# EAGLE design pfetreg (EAGLE 7.3.0)
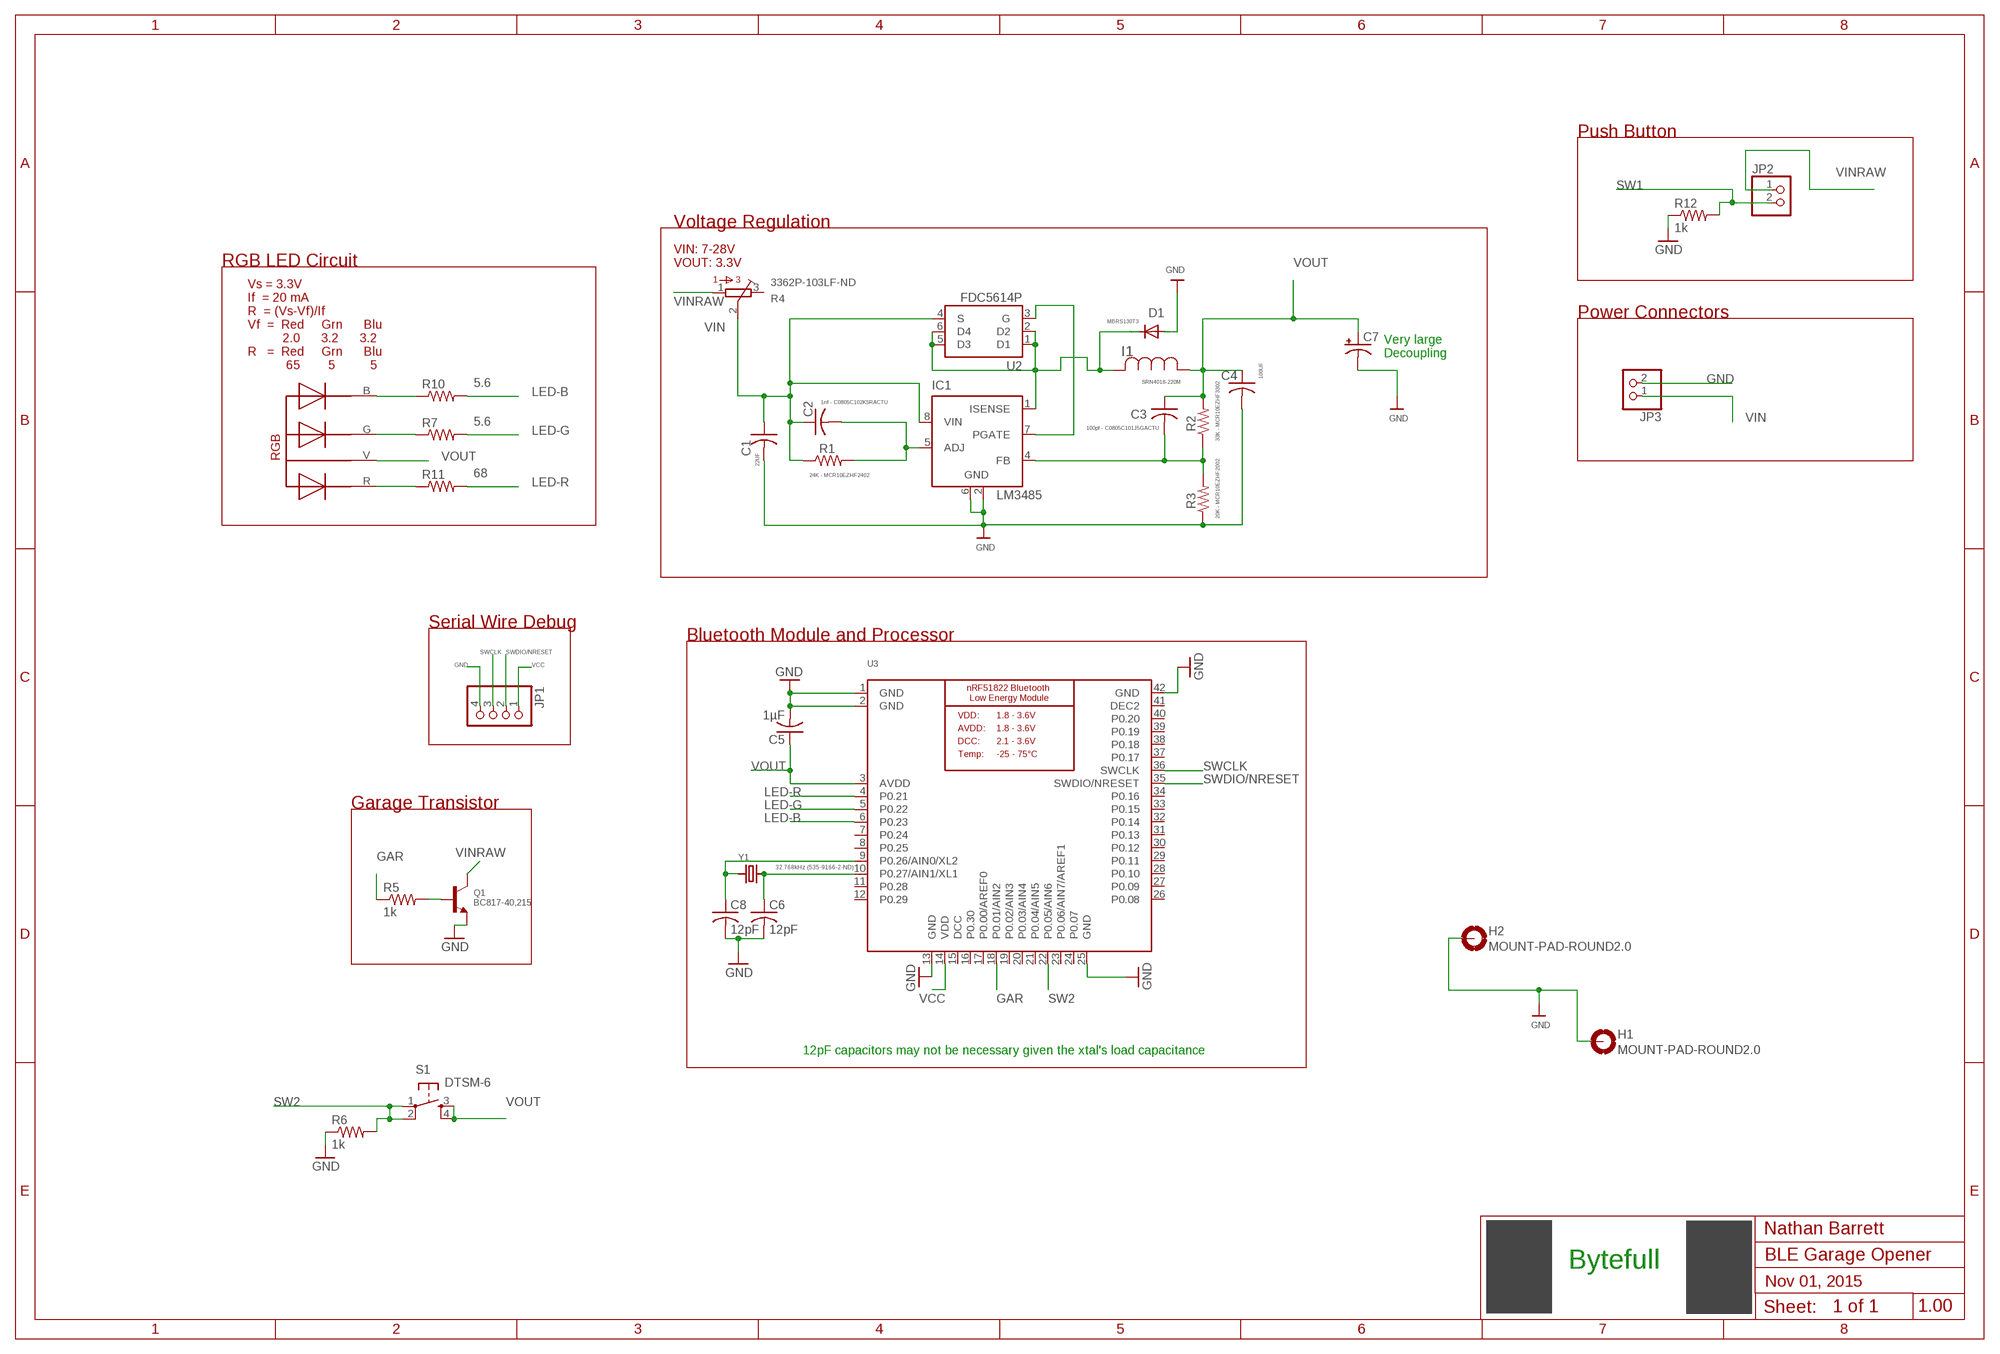
[diagram p0: schematic, sheet 1]

## Parts
C1  22UF  F931V226MNC  [CAPCP7343X430N]
C2  1nf - C0805C102K5RACTU  C-USC0805K  [C0805K]
C3  100pf - C0805C101J5GACTU  C-USC0805K  [C0805K]
C4  100UF  6TPC100M  [CAPCP7343X430N]
C5  1µF  C-USC0805K  [C0805K]
C6  12pF  C-USC0805  [C0805]
C7  CPOL-USE5-10.5  [E5-10,5]
C8  12pF  C-USC0805  [C0805]
D1  MBRS130T3  DIODE-DO214AA  [DO214AA]
H1  MOUNT-PAD-ROUND2.0  [2,0-PAD]
H2  MOUNT-PAD-ROUND2.0  [2,0-PAD]
I1  SRN4018-220M  [SRN4018-220M]
IC1  LM3485  [MSOP08]
JP1  PINHD-1X4  [1X04]
JP2  PINHD-1X2  [1X02]
JP3  PINHD-1X2  [1X02]
Q1  BC817-40,215  TRANSISTOR_NPN  [SOT23-R]
R1  24K - MCR10EZHF2402  R-US_R0805W  [R0805W]
R2  33K - MCR10EZHF3302  R-US_R0805W  [R0805W]
R3  20K - MCR10EZHF2002  R-US_R0805W  [R0805W]
R4  3362P-103LF-ND  3362P  [3362P]
R5  1k  R-US_R0805  [R0805]
R6  1k  R-US_R0805  [R0805]
R7  5.6  R-US_R0805  [R0805]
R10  5.6  R-US_R0805  [R0805]
R11  68  R-US_R0805  [R0805]
R12  1k  R-US_R0805  [R0805]
RGB  5MMRGBLED  [LED5MMRGB]
S1  DTSM-6  [DTSM-6]
U2  FDC5614PSOT-23  [SOT23-6]
U3  NRF51822_MODULE_MDBT40  [BLE_MODULE_RAYTAC_MDBT40]
Y1  CRYSTAL8X3.8SMT  [CRYSTAL_8X3.8]

## Nets
GAR: R5.1 U3.18(P0.01/AIN2)
GND: C1.2(I2) C4.2(I2) C5.2 C6.2 C7.- C8.2 D1.A H1.B2,8(MOUNT) H2.B2,8(MOUNT) IC1.2(GND) IC1.6(GND) JP1.4 JP3.2 Q1.2(E) R3.1 R6.1 R12.1 U3.1(GND) U3.2(GND) U3.13(GND) U3.25(GND) U3.42(GND)
LED-B: R10.2 U3.6(P0.23)
LED-G: R7.2 U3.5(P0.22)
LED-R: R11.2 U3.4(P0.21)
N$1: D1.C I1.1(I1) IC1.1(ISENSE) U2.1(D1) U2.2(D2) U2.5(D3) U2.6(D4)
N$2: C3.2 IC1.4(FB) R2.1 R3.2
N$3: IC1.7(PGATE) U2.3(G)
N$4: C2.2 IC1.5(ADJ) R1.2
N$5: Q1.1(B) R5.2
N$6: R7.1 RGB.G
N$7: R10.1 RGB.B
N$8: R11.1 RGB.R
N$11: C8.1 U3.9(P0.26/AIN0/XL2) Y1.P$1
N$16: C6.1 U3.10(P0.27/AIN1/XL1) Y1.P$4
SW1: JP2.2 R12.2
SW2: R6.2 S1.1 S1.2 U3.22(P0.05/AIN6)
SWCLK: JP1.3 U3.36(SWCLK)
SWDIO/NRESET: JP1.2 U3.35(SWDIO/NRESET)
VCC: JP1.1 U3.14(VDD)
VIN: C1.1(I1) C2.1 IC1.8(VIN) JP3.1 R1.1 R4.2 U2.4(S)
VINRAW: JP2.1 Q1.3(C) R4.1
VOUT: C3.1 C4.1(I1) C5.1 C7.+ I1.2(I2) R2.2 RGB.V S1.3 S1.4 U3.3(AVDD)
Unconnected: R4.3 U3.7(P0.24) U3.8(P0.25) U3.11(P0.28) U3.12(P0.29) U3.16(P0.30) U3.17(P0.00/AREF0) U3.19(P0.02/AIN3) U3.20(P0.03/AIN4) U3.21(P0.04/AIN5) U3.23(P0.06/AIN7/AREF1) U3.24(P0.07) U3.26(P0.08) U3.27(P0.09) U3.28(P0.10) U3.29(P0.11) U3.30(P0.12) U3.31(P0.13) U3.32(P0.14) U3.33(P0.15) U3.34(P0.16) U3.37(P0.17) U3.38(P0.18) U3.39(P0.19) U3.40(P0.20)

## Notes on the sheet
- Push Button
- Voltage Regulation
- RGB LED Circuit
- VIN: 7-28V
  VOUT: 3.3V
- Power Connectors
- Very large
  Decoupling
- Vs = 3.3V
  If  = 20 mA
  R  = (Vs-Vf)/If
  Vf  =  Red     Grn      Blu
            2.0      3.2      3.2
  R   =  Red     Grn      Blu
             65        5          5
- Serial Wire Debug
- Bluetooth Module and Processor
- Garage Transistor
- 32.768kHz (535-9166-2-ND)
- 12pF capacitors may not be necessary given the xtal's load capacitance

## Power pins joined to a net without a drawn wire
DCC: U3.15(DCC)
DEC2: U3.41(DEC2)

## Library data of the parts
C1 = pfetreg:F931V226MNC: Tantalum Capacitor , 2917; CAPACITANCETOLERANCE: ±20%; MPN: F931V226MNC; SUPPLIER: AVX; VOLTAGERATING: 35V
C2 C3 = Bluetooth-Garage:C-US: CAPACITOR, American symbol
C4 = pfetreg:6TPC100M: Poly Capacitor , 2917; CAPACITANCETOLERANCE: ±20%; MPN: 6TPC100M; SUPPLIER: PANASONIC; VOLTAGERATING: 6.3V
C5 C6 C8 = HelloWorld:C-US: CAPACITOR, American symbol
C7 = rcl:CPOL-US: POLARIZED CAPACITOR, American symbol
D1 = diode:DIODE-: DIODE
H1 H2 = holes:MOUNT-PAD-ROUND: MOUNTING PAD, round
I1 = pfetreg:SRN4018-220M: FIXED IND 22UH 900MA 348 MOHM SRN4018-220M
IC1 = linear:LM3485: Hysteretic PFET Buck Controller Source: http://cache.national.com/ds/LM/LM3485.pdf
JP1 = HelloWorld:PINHD-1X4: PIN HEADER
JP2 JP3 = pinhead:PINHD-1X2: PIN HEADER
Q1 = HelloWorld:TRANSISTOR_NPN: NPN Transistor Transistor (NPN) 500mA 45V - BC817 [Digikey: 568-1631-1-ND] Transistor (NPN) 500mA 45V - BC817,215 [Mouser: 771-BC817-T/R] SOT23-R - SOT23 footprint optimised for use with solder paste and reflow ovens. SOT23-W - SOT23 footprint optimised for hand-soldering (larger pads).
R1-R3 = Bluetooth-Garage:R-US_: RESISTOR, American symbol
R4 = Bourns:3362: 3362 Series 1/4" Square Trimmer
R5-R7 R10-R12 = HelloWorld:R-US_: RESISTOR, American symbol
RGB = led_rgb:5MMRGBLED
S1 = HelloWorld:DTSM-6
U2 = pfetreg:FDC5614P: Fairchild P-channel MOSFET -60V FDC5614P , SOT23-6
U3 = HelloWorld:NRF51822_MODULE_MDBT40: nRF51822 Bluetooth Low Energy Module
Y1 = HelloWorld:CRYSTAL: Crystals HC49UP - Surface Mount Crystal 4.0MHz 18pF +/-30ppm Surface Mount Crystal [Digikey: 535-9857-1-ND] 12.0 MHz Surface Mount Crystal [Digikey: 535-9869-6-ND] 25.0 MHz Surface Mount Crystal [Digikey: 535-9078-1-ND] 2.5 x 2.0mm - MEMs SMT Crystal 16.0 MHz 10pF 20ppm 2.5 x 2.0mm Crystal [Digikey -40-85°C: 535-10923-1-ND] 3.2 x 2.5mm - MEMs SMT Crystal 12.0 MHz 8pF 15ppm 3.2 x 2.5mm Crystal [Digikey: -10-70°C: 644-1047-1-ND -40-125°C: 644-1128-1-ND] 16.0 MHz 8pF 15ppm 3.2 x 2.5mm Crystal [Digikey: -10-70°C: 644-1049-1-ND -40-125°C: 644-1129-2-ND] 16.0 MHz 10pF 10ppm 3.2 x 2.5mm Crystal [Digikey: 644-1100-1-ND] 27.12 MHz 18pF 30ppm 3.2 x 2.5mm Crystal [Digikey: 887-1424-1-ND] 27.12MHz 10pF 10ppm 3.2 x 2.5mm Crystal [Digikey: 887-1329-1-ND] 4.9 x 1.8mm - MEMs SMT Crystal 32.768 KHz 12.5pF 20ppm 4.9 x 1.8mm Crystal [Digikey: SE2415CT-ND] 8.0 x 3.8mm - Surface Mount Crystal 32.768kHz 12.5pF 20ppm -40°C-85°C [Digikey: 535-9166-2-ND] Cylinder 32.768KHz Cylinder Crystal (2x6mm body) [Ex. Digikey: 300-8341-2-ND]

## Board
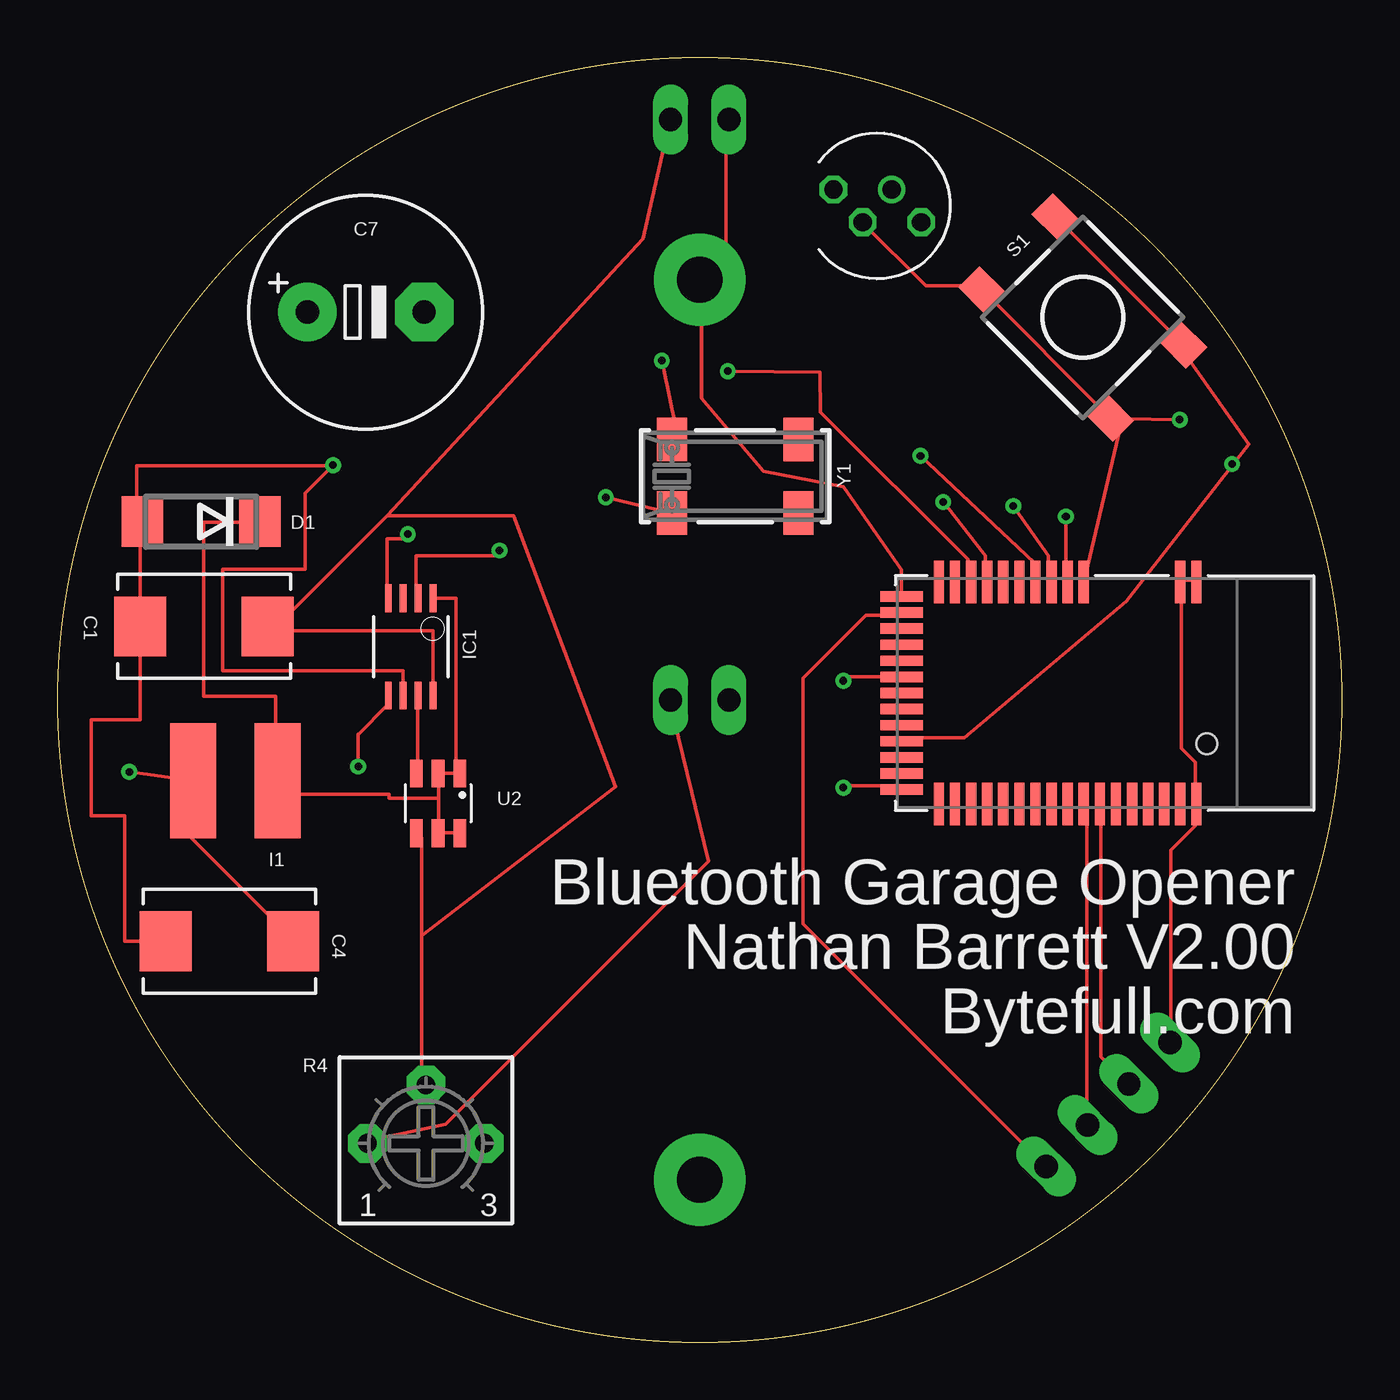
[diagram p1: board, top side]
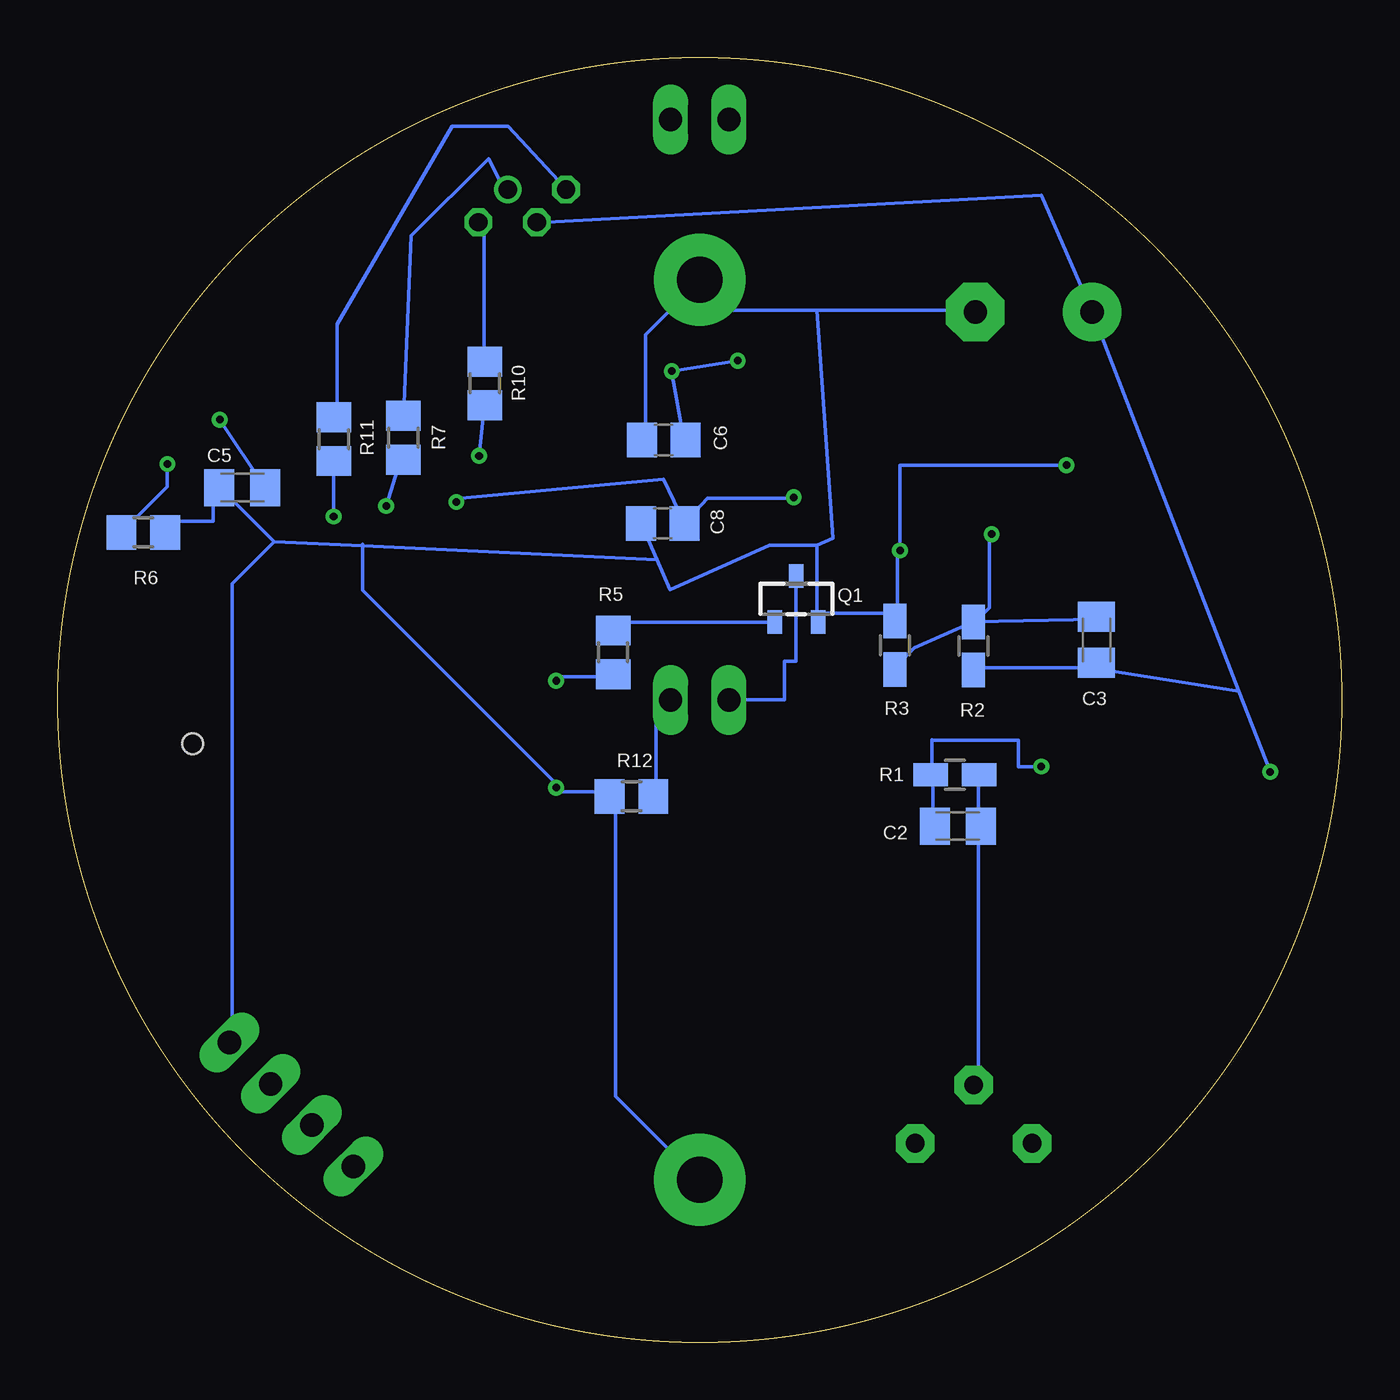
[diagram p2: board, bottom side, seen from below]

Size 55.88 x 55.88 mm. Coordinates in mm from the lower left corner, seen from the top.
Outline: circle at 27.94,27.94 radius 27.94
Copper layers (1*16): Top 0.0356mm / dielectric 1.5011mm / Bottom 0.0356mm
Design rules "oshpark-2layer(2)": minimum track width 6mil, minimum drill 13mil, track to track 6mil, track to pad 6mil, pad to pad 6mil, via to via 6mil, smd to smd 6mil, copper to edge 15mil, drill to drill 6mil, minimum pad ring 7mil, minimum via ring 7mil, stop-mask expansion 4mil, vias tented up to drill 0mil, thermal gap 10mil

### Footprints (pad centres in the part's own frame; a part is rotated, then mirrored left to right if it is on the bottom)
CAPCP7343X430N = smd 2.261 x 2.591: 1 -2.769,0; 2 2.769,0
C0805K = smd 1.3 x 1.6: 1 -1,0; 2 1,0
C0805 = smd 1.3 x 1.5: 1 -0.95,0; 2 0.95,0
E5-10,5 = drill 1.016 pad 2.54: + -2.54,0 | drill 1.016 pad 2.54 octagon: - 2.54,0
DO214AA = smd 1.8 x 2.2: A 2.55,0; C -2.55,0
2,0-PAD = drill 2 pad 4: B2,8 0,0
SRN4018-220M = smd 1.999 x 5: 1 4.37,0; 2 0.69,0
MSOP08 = smd 0.3 x 1.2: 1 -0.976,-2.113; 2 -0.326,-2.113; 3 0.324,-2.113; 4 0.974,-2.113; 5 0.974,2.112; 6 0.324,2.112; 7 -0.326,2.112; 8 -0.976,2.112
1X04 = drill 1.016 long: 1 -3.81,0; 2 -1.27,0; 3 1.27,0; 4 3.81,0
1X02 = drill 1.016 long: 1 -1.27,0; 2 1.27,0
SOT23-R = smd 0.635 x 1.016: 1 -0.95,-1; 2 0.95,-1; 3 0,1
R0805W = smd 1.5 x 1: 1 -1.052,0; 2 1.052,0
3362P = drill 0.813 pad 1.676 octagon: 1 -2.54,0; 2 0,2.54; 3 2.54,0
R0805 = smd 1.3 x 1.5: 1 -0.95,0; 2 0.95,0
LED5MMRGB = drill 0.8 pad 0.813 octagon: B 1.905,-0.714; R -1.905,0.714; V -0.635,-0.714 | drill 0.8 pad 0.813: G 0.635,0.714
DTSM-6 = smd 1.55 x 1.3: 1 -3.975,2.25; 2 3.975,2.25; 3 -3.975,-2.25; 4 3.975,-2.25
SOT23-6 = smd 0.55 x 1.2: 1 0.95,1.3; 2 0,1.3; 3 -0.95,1.3; 4 -0.95,-1.3; 5 0,-1.3; 6 0.95,-1.3
BLE_MODULE_RAYTAC_MDBT40 = smd 1.85 x 0.45: 1 -4.825,4; 2 -4.825,3.3; 3 -4.825,-0.9; 4 -4.825,-1.6; 5 -4.825,-2.3; 6 -4.825,-3; 7 -4.825,-3.7; 8 -4.825,-4.4; 9 -4.825,-5.1; 10 -4.825,-5.8; 11 -4.825,-6.5; 12 -4.825,-7.2; 26 4.825,-7.2; 27 4.825,-6.5; 28 4.825,-5.8; 29 4.825,-5.1; 30 4.825,-4.4; 31 4.825,-3.7; 32 4.825,-3; 33 4.825,-2.3; 34 4.825,-1.6; 35 4.825,-0.9; 36 4.825,-0.2; 37 4.825,0.5; 38 4.825,1.2; 39 4.825,1.9; 40 4.825,2.6; 41 4.825,3.3; 42 4.825,4 | smd 0.45 x 1.85: 13 -4.2,-8.825; 14 -3.5,-8.825; 15 -2.8,-8.825; 16 -2.1,-8.825; 17 -1.4,-8.825; 18 -0.7,-8.825; 19 0,-8.825; 20 0.7,-8.825; 21 1.4,-8.825; 22 2.1,-8.825; 23 2.8,-8.825; 24 3.5,-8.825; 25 4.2,-8.825 | hole 0.9: 2.2,4.45
CRYSTAL_8X3.8 = smd 1.3 x 1.9: P$1 -2.75,-1.6; P$2 2.75,-1.6; P$3 2.75,1.6; P$4 -2.75,1.6

### Placement (x,y rotation side)
C1  6.38,31.14 180 top
C2  16.71,22.45 180 bottom
C3  10.68,30.56 90 bottom
C4  7.48,17.45 180 top
C5  47.84,37.17 180 bottom
C6  29.5,39.24 180 bottom
C7  13.41,44.81 0 top
C8  29.55,35.62 180 bottom
D1  6.25,35.7 180 top
H1  27.94,46.2 0 top
H2  27.94,7.08 0 top
I1  5.21,24.42 0 top
IC1  15.37,30.25 180 top
JP1  45.71,10.35 45 top
JP2  27.94,27.94 0 top
JP3  27.94,53.19 0 top
Q1  23.74,32.33 0 bottom
R1  16.84,24.69 180 bottom
R2  16.04,30.29 270 bottom
R3  19.44,30.33 270 bottom
R4  16.03,8.66 0 top
R5  31.71,30.01 90 bottom
R6  52.15,35.23 180 bottom
R7  40.83,39.34 270 bottom
R10  37.29,41.71 270 bottom
R11  43.85,39.28 270 bottom
R12  30.91,23.75 0 bottom
RGB  35.66,49.43 0 top
S1  44.6,44.58 315 top
U2  16.56,23.44 0 top
U3  45.54,28.24 270 top
Y1  29.48,37.67 0 top

### Tracks (layer width: path | path; a pad name or v marks a point on that pad's centre or on a via)
GAR  (via drill 0.33)
  Top 0.152: 36.7,29.03 U3.18 36.6,28.95 34.35,28.95 v34.19,28.78
  Bottom 0.152: 31.83,29.03 R5.1 31.85,28.95 34.1,28.95 v34.19,28.78
GND  (via drill 0.33, 0.33 pad 0.15)
  Top 0.152: 36.7,24 U3.25 36.6,24.2 34.35,24.2 v34.19,24.13 | 3.63,31.01 C1.2 | U3.1 49.5,33.15 48.89,33.15 U3.2 48.89,32.99 48.89,25.83 49.5,25.22 49.5,23.55 U3.42 49.5,23.39 49.5,22.48 48.44,21.41 48.44,13.18 JP1.4 | U3.13 36.7,32.54 36.7,33.6 34.19,37.21 30.71,37.9 28.02,41.07 28.02,46.1 H1.B2,8 28.02,46.25 29.08,47.32 29.08,53.11 JP3.2 | 15.82,44.73 C7.- | IC1.2 15.6,32.45 15.6,34.2 19.1,34.2 v19.23,34.44 | 15.01,27.84 IC1.6 15.04,29.21 7.19,29.21 7.19,33.63 10.77,33.63 10.77,36.93 v11.99,38.15 11.99,38.13 3.45,38.13 3.45,35.7 D1.A 3.61,35.7 C1.2 | C4.2 2.92,17.45 2.92,22.91 1.47,22.91 1.47,27.08 3.61,27.08 C1.2
  Bottom 0.152: 32.13,24 31.98,23.85 R12.1 | 22.68,31.32 Q1.2 | 30.45,35.59 C8.2 | C6.2 30.3,39.24 30.3,43.81 28.02,46.1 H1.B2,8 27.86,46.1 26.64,44.88 22.85,44.88 | 46.46,34.82 48.74,37.11 C5.2 49.1,36.7 49.1,35.7 51.1,35.7 R6.1 | 30.61,35.59 C8.2 | 22.83,34.67 22.83,31.47 Q1.2 | 22.85,44.88 15.98,44.88 C7.- | 46.46,34.82 48.29,32.99 48.29,13.18 JP1.4 | R12.1 32.1,23.95 34.1,23.95 v34.19,24.13 34.1,24.2 42.6,32.7 42.6,34.7 42.6,34.64 | 22.83,34.67 24.92,34.67 29.24,32.74 29.81,34.04 | 29.81,34.04 C8.2 | 46.46,34.82 42.6,34.64 | 42.6,34.64 29.81,34.04 | 22.85,44.88 22.14,34.98 22.83,34.67 | Q1.2 22.6,31.7 19.6,31.7 R3.1 19.35,31.45 19.35,34.2 v19.23,34.44 19.23,38.15 v11.99,38.15 | H2.B2,8 28.1,7.2 31.6,10.7 31.6,23.7 R12.1
LED-B  (via drill 0.33)
  Top 0.152: v37.54,38.56 42.49,33.91 42.49,33.15 U3.6
  Bottom 0.152: v37.54,38.56 37.31,40.61 R10.2
LED-G  (via drill 0.33)
  Top 0.152: v41.58,36.37 43.1,34.21 43.1,33.15 U3.5
  Bottom 0.152: v41.58,36.37 40.97,38.33 R7.2
LED-R  (via drill 0.33)
  Top 0.152: v43.87,35.92 43.87,33.15 U3.4
  Bottom 0.152: v43.87,35.92 R11.2
N$1
  Top 0.152: 16.59,22.17 17.5,22.17 U2.6 | 16.59,23.67 16.59,24.61 U2.2 16.59,24.76 17.5,24.76 U2.1 17.35,24.95 17.35,28.7 | 16.59,23.67 16.59,22.17 | 16.59,22.17 U2.5 | 16.35,32.2 IC1.1 17.35,32.36 17.35,28.7 | 16.59,23.67 14.43,23.67 14.43,23.85 10.19,23.85 9.73,24.31 I1.1 9.5,24.42 9.5,28.09 6.35,28.09 6.35,35.66 8.8,35.66 D1.C | 17.35,28.7
N$2  (via drill 0.33)
  Top 0.152: IC1.4 14.35,32.45 14.35,34.95 15.1,34.95 v15.24,35.15
  Bottom 0.152: 15.82,31.17 15.98,31.32 R2.1 | v15.24,35.15 15.35,34.95 15.35,31.95 15.85,31.45 R2.1 | R3.2 19.35,29.45 18.6,30.2 R2.1 | C3.2 10.6,31.45 R2.1
N$3
  Top 0.152: U2.3 15.67,24.76 15.67,28.12 IC1.7
N$4  (via drill 0.33)
  Top 0.152: IC1.5 14.35,27.95 14.35,27.7 13.1,26.45 13.08,26.45 v13.08,25.04
  Bottom 0.152: 17.81,24.76 R1.2 | C2.2 17.81,22.48 17.81,24.61 R1.2 | 17.85,26.19 17.85,24.7 R1.2 | v13.08,25.04 14.07,25.04 14.07,26.19 17.85,26.19 | 17.85,26.19 17.85,26.2
N$5
  Bottom 0.152: Q1.1 24.82,31.32 31.37,31.32 31.67,31.01 R5.2
N$6
  Bottom 0.152: R7.1 40.82,40.31 40.49,48.13 37.13,51.49 36.4,50.06 RGB.G
N$7
  Bottom 0.152: R10.1 37.31,42.75 37.31,48.54 37.46,48.69 RGB.B
N$8
  Bottom 0.152: R11.1 43.71,40.31 43.71,44.27 38.71,52.88 36.27,52.88 33.81,50.22 RGB.R
N$11  (via drill 0.33)
  Top 0.152: 26.8,36.19 Y1.P$1 v23.85,36.75 | v38.53,36.55 40.36,34.21 40.36,33.15 U3.9
  Bottom 0.152: 28.47,35.74 C8.1 | 28.6,35.7 C8.1 | v23.85,36.75 24.1,36.7 27.6,36.7 C8.1 | v38.53,36.55 38.35,36.7 29.51,37.54 C8.1
N$16  (via drill 0.33)
  Top 0.152: v26.29,42.7 26.95,39.55 26.8,39.4 Y1.P$4 | U3.10 39.6,33.15 39.6,34.06 33.2,40.46 33.17,42.19 v29.16,42.24
  Bottom 0.152: 28.47,39.24 C6.1 28.63,39.24 v29.16,42.24 v26.29,42.7
SW1
  Bottom 0.152: R12.2 29.84,23.85 29.84,27.2 29.24,27.81 JP2.2
SW2  (via drill 0.33)
  Top 0.152: 36.7,26.14 U3.22 36.86,26.29 39.45,26.29 46.51,32.23 51.13,38.18 | 51.13,38.18 51.82,39.07 48.89,43.21 S1.2 S1.1 | v51.1,38.2 51.13,38.18
  Bottom 0.152: v51.1,38.2 51.1,37.2 52.6,35.7 R6.2
SWCLK
  Top 0.152: U3.36 45.39,23.39 45.39,12.42 46.46,11.35 JP1.3
SWDIO/NRESET
  Top 0.152: U3.35 44.78,23.39 44.78,9.52 JP1.2
VCC
  Top 0.152: U3.14 36.7,31.62 35.18,31.62 32.44,28.88 32.44,18.21 42.95,7.7 JP1.1
VIN
  Top 0.152: 15.85,17.68 15.85,11.2 R4.2 | 15.85,17.68 15.85,21.95 U2.4 | IC1.8 16.35,28.2 16.35,30.84 16.33,30.84 16.33,30.95 9.35,30.95 C1.1 9.35,31.2 9.6,31.2 14.35,35.95 | 14.35,35.95 25.48,48 26.6,52.95 JP3.1 | 14.35,35.95 19.85,35.95 24.27,24.17 15.85,17.68
  Bottom 0.152: R1.1 15.82,24.61 15.82,22.48 C2.1 15.82,22.33 15.82,11.35 15.98,11.2 R4.2
VINRAW
  Top 0.152: R4.1 13.54,8.76 16.89,9.5 28.32,20.93 26.64,27.81 JP2.1
  Bottom 0.152: Q1.3 23.75,33.3 23.75,29.62 24.26,29.62 24.26,27.94 JP2.1
VOUT  (via drill 0.33)
  Top 0.152: RGB.V 35.03,48.69 37.77,45.95 40.06,45.95 S1.3 45.69,40.31 S1.4 46.33,40.17 | C4.1 10.19,17.45 9.37,18.39 5.11,22.66 5.92,24.31 I1.2 v3.12,24.82 | v48.82,40.13 46.33,40.17 | U3.3 46.33,40.17
  Bottom 0.152: 10.95,29.34 15.98,29.34 R2.2 | 10.95,29.34 10.79,29.49 C3.1 | RGB.V 35.03,48.69 13.08,49.89 C7.+ 4.48,28.33 | v3.12,24.82 4.48,28.33 | 10.95,29.34 4.48,28.33 | C5.1 v48.82,40.13

### Text on the board
tNames: Bluetooth Garage Opener / Nathan Barrett V2.00 / Bytefull.com